# Altium schematic sheet MPPT_V1.0.1_Main.SchDoc: MPPT_V1.0
size A4; DrawnBy: Hugo Boyce; Engineer: Hugo Boyce; Organization: Altium Limited; Address1: L3, 12a Rodborough Rd; Address2: Frenchs Forest; Address3: NSW; Address4: Australia 2086; SheetNumber: 1; SheetTotal: 5
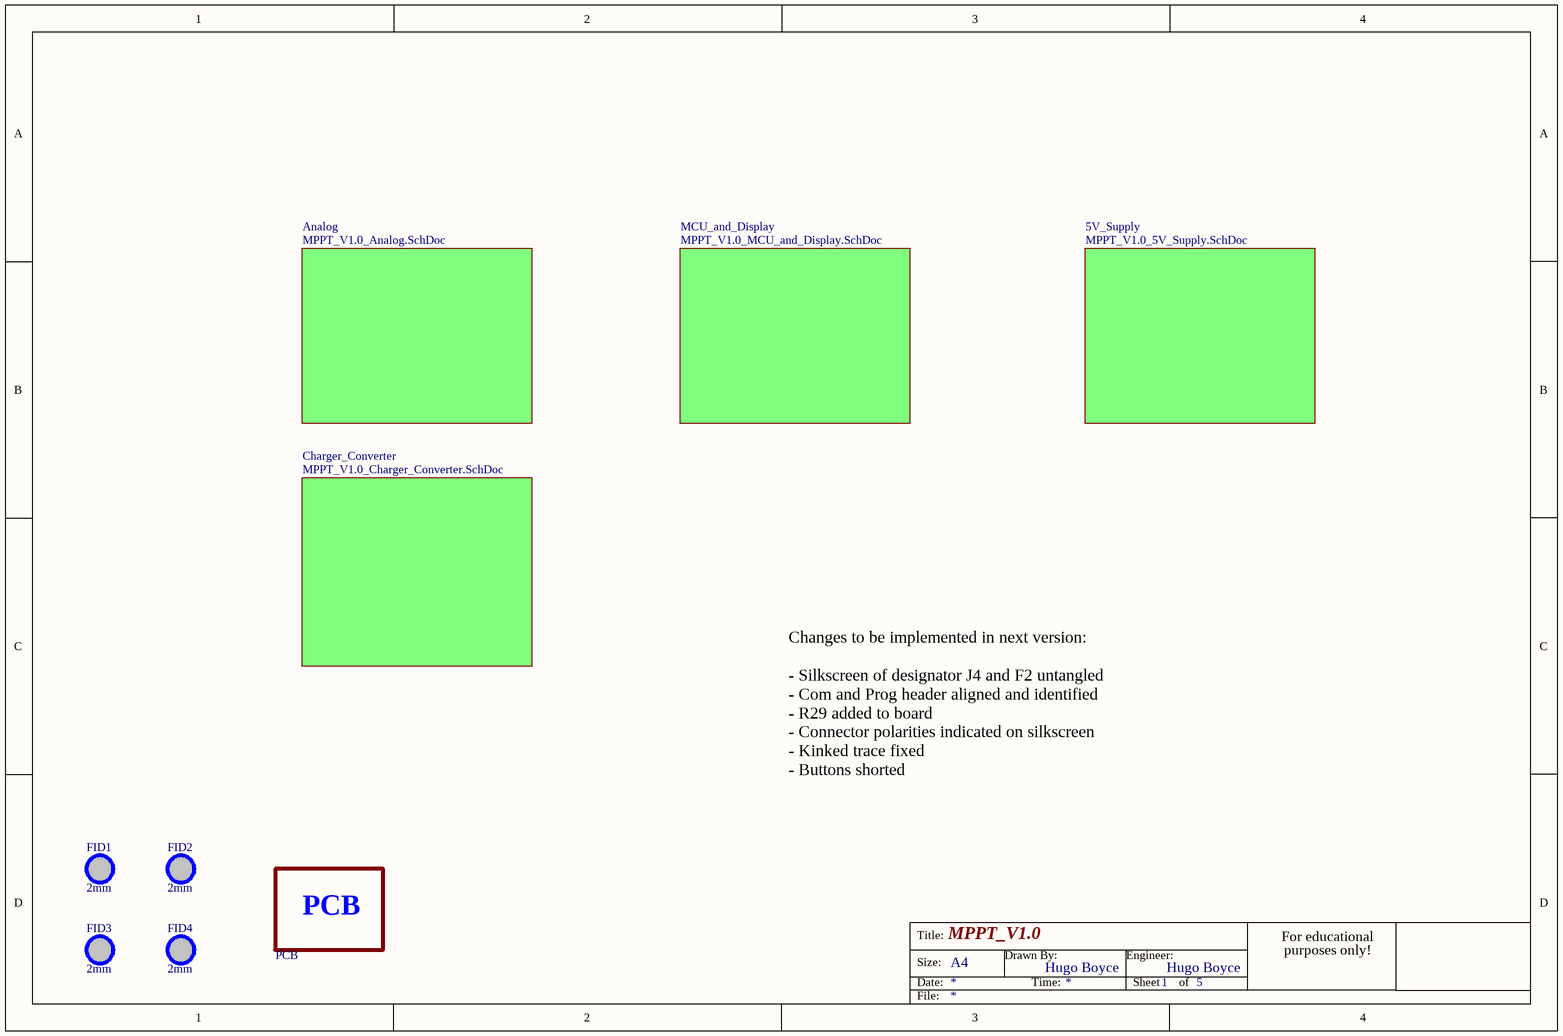
[diagram p0: MPPT_V1.0.1_Main.SchDoc]

## Parts
FID1  2mm  [FID_2MM]  (no BOM)
FID2  2mm  [FID_2MM]  (no BOM)
FID3  2mm  [FID_2MM]  (no BOM)
FID4  2mm  [FID_2MM]  (no BOM)
PCB  PCB  (value not drawn)

## Sub-sheets
5V_Supply = MPPT_V1.0_5V_Supply.SchDoc: no entries
Analog = MPPT_V1.0_Analog.SchDoc: no entries
Charger_Converter = MPPT_V1.0_Charger_Converter.SchDoc: no entries
MCU_and_Display = MPPT_V1.0_MCU_and_Display.SchDoc: no entries

## Notes on the sheet
- Changes to be implemented in next version:
  - Silkscreen of designator J4 and F2 untangled
  - Com and Prog header aligned and identified
  - R29 added to board
  - Connector polarities indicated on silkscreen
  - Kinked trace fixed
  - Buttons shorted
- Title:
- Size:
- Date:
- A4
- Drawn By:
- Time:
- Engineer:
- Sheet
- of
- For educational
- purposes only!
- File:

## Library data of the parts
FID1-FID4 = FID_2mm: Fiducial, 2mm
PCB = PCB: Printed Circuit Board